# Altium schematic sheet Sheet1.SchDoc
size A
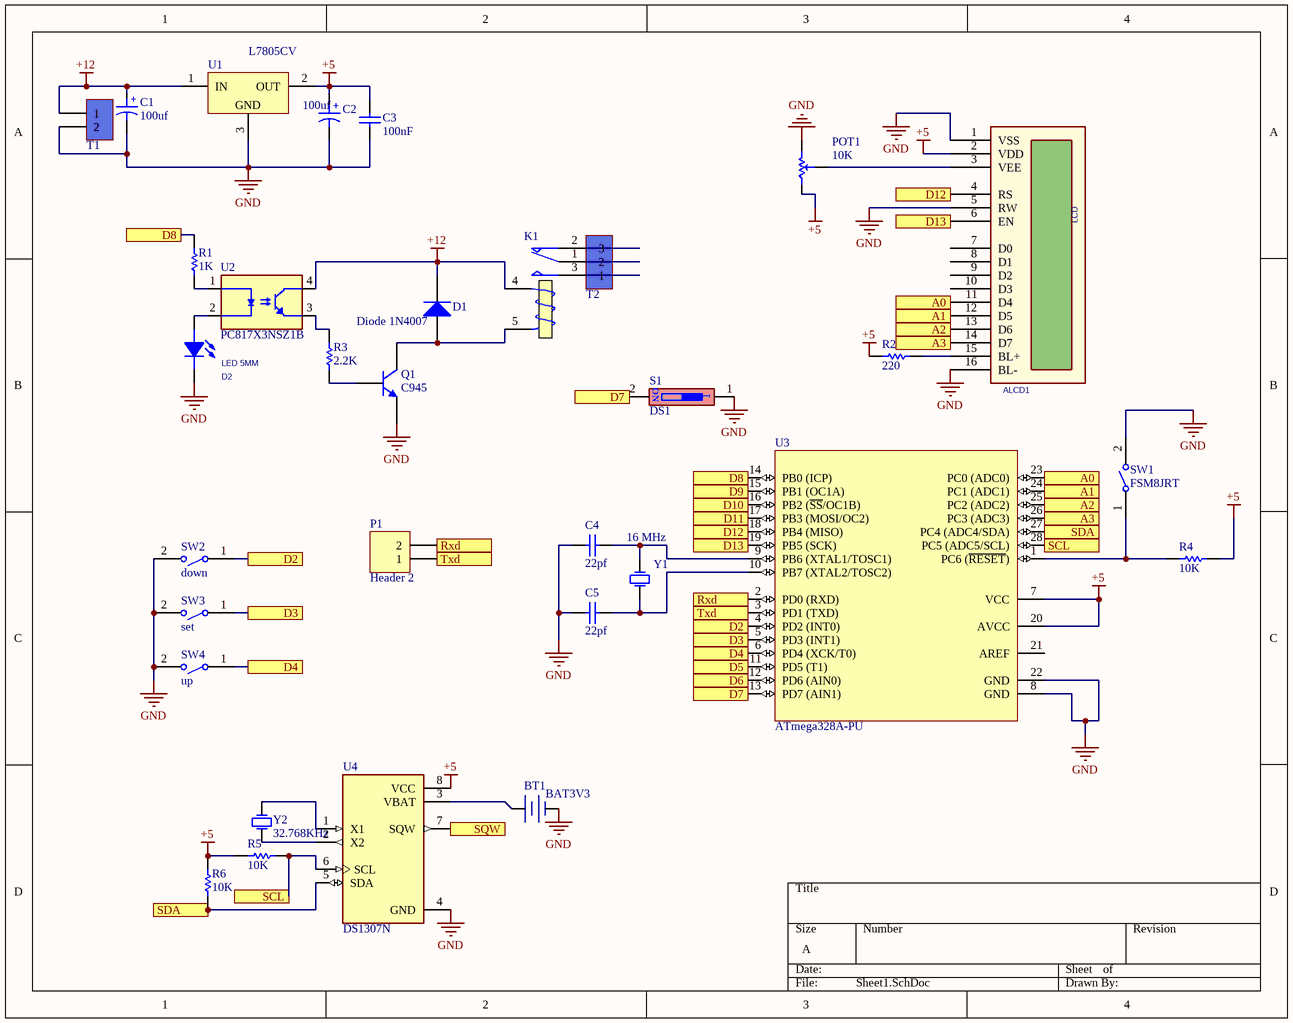
[diagram p0: Sheet1.SchDoc]

## Parts
ALCD1  LCD  [LCD_2X16]
BT1  BAT3V3  [BTH1220]
C1  100uf  [Cap electrolitic radial 8x14-3.5]
C2  100uf  [Cap electrolitic radial 8x14-3.5]
C3  100nF  [Cap-100nF]
C4  22pf  [Cap-100nF]
C5  22pf  [Cap-100nF]
D1  Diode 1N4007  [DO-41]
D2  LED 5MM  [LED5MM_GRN]
K1  (no value)  [Relay 18.85x15.35x15.70]
P1  Header 2  [HDR1X2]
POT1  10K  [POT 4]
Q1  C945  [C945]
R1  1K  [RES-(1/4)]
R2  220  [RES-(1/4)]
R3  2.2K  [RES-(1/4)]
R4  10K  [RES-(1/4)]
R5  10K  [RES-(1/4)]
R6  10K  [RES-(1/4)]
S1  DS1  [DIP Switch x1]
SW1  FSM8JRT  [TE_FSM8JRT]
SW2  down  [TE_FSM8JRT]
SW3  set  [TE_FSM8JRT]
SW4  up  [TE_FSM8JRT]
T1  Terminal  [Terminal 1*2]  (value not drawn)
T2  Terminal  [Terminal 1*3]  (value not drawn)
U1  L7805CV  [78XXCV]
U2  PC817X3NSZ1B  [DIP762W50P254L495H455Q4]
U3  ATmega328A-PU  [28P3]
U4  DS1307N  [DIP762W47P254L991H457Q8]
Y1  16 MHz  [XTAL 16MHZ]
Y2  32.768KHz  [XTAL RTC]

## Ports
A0, A1, A2, A3, D2, D3, D4, D5, D6, D7, D8, D9, D10, D11, D12, D13, Rxd, SCL, SDA, SQW, Txd

## Nets
+5: ALCD1.2(VDD) C2.1 C3.2 POT1.1(CCW) R2.1 R4.2 R5.1 R6.2 U1.2(OUT) U3.7(VCC) U3.20(AVCC) U4.8(VCC)
+12: C1.1 D1.2(K) K1.4(T1) T1.1 U1.1(IN) U2.4(COLLECTOR)
GND: ALCD1.1(VSS) ALCD1.5(RW) ALCD1.16(BL-) BT1.2(-) C1.2 C2.2 C3.1 C4.2 C5.2 D2.2(CATHODE) POT1.2(CW) Q1.1(E) S1.1 SW1.2 SW2.2 SW3.2 SW4.2 T1.2 U1.3(GND) U3.8(GND) U3.22(GND) U4.4(GND)
A0: ALCD1.11(D4) U3.23(PC0_(ADC0)) ; port A0
A1: ALCD1.12(D5) U3.24(PC1_(ADC1)) ; port A1
A2: ALCD1.13(D6) U3.25(PC2_(ADC2)) ; port A2
A3: ALCD1.14(D7) U3.26(PC3_(ADC3)) ; port A3
D2: SW2.1 U3.4(PD2_(INT0)) ; port D2
D3: SW3.1 U3.5(PD3_(INT1)) ; port D3
D4: SW4.1 U3.6(PD4_(XCK/T0)) ; port D4
D5: U3.11(PD5_(T1)) ; port D5
D6: U3.12(PD6_(AIN0)) ; port D6
D7: S1.2 U3.13(PD7_(AIN1)) ; port D7
D8: R1.2 U3.14(PB0_(ICP)) ; port D8
D9: U3.15(PB1_(OC1A)) ; port D9
D10: U3.16(PB2_(~{SS}/OC1B)) ; port D10
D11: U3.17(PB3_(MOSI/OC2)) ; port D11
D12: ALCD1.4(RS) U3.18(PB4_(MISO)) ; port D12
D13: ALCD1.6(EN) U3.19(PB5_(SCK)) ; port D13
Rxd: P1.2 U3.2(PD0_(RXD)) ; port Rxd
SCL: R5.2 U3.28(PC5_(ADC5/SCL)) U4.6(SCL) ; port SCL
SDA: R6.1 U3.27(PC4_(ADC4/SDA)) U4.5(SDA) ; port SDA
SQW: U4.7(SQW) ; port SQW
Txd: P1.1 U3.3(PD1_(TXD)) ; port Txd
NetALCD1_3: ALCD1.3(VEE) POT1.3(SetPoint)
NetALCD1_15: ALCD1.15(BL+) R2.2
NetBT1_1: BT1.1(+) U4.3(VBAT)
NetC4_1: C4.1 U3.9(PB6_(XTAL1/TOSC1)) Y1.2(OSC2)
NetC5_1: C5.1 U3.10(PB7_(XTAL2/TOSC2)) Y1.1(OSC1)
NetD1_1: D1.1(A) K1.5(T2) Q1.2(C)
NetD2_1: D2.1(ANODE) U2.2(CATHODE)
NetK1_1: K1.1(COM) T2.2
NetK1_2: K1.2(NC) T2.3
NetK1_3: K1.3(NO) T2.1
NetQ1_3: Q1.3(B) R3.1
NetR1_1: R1.1 U2.1(ANODE)
NetR3_2: R3.2 U2.3(EMITTER)
NetR4_1: R4.1 SW1.1 U3.1(PC6_(~{RESET}))
NetU4_1: U4.1(X1) Y2.2(OSC2)
NetU4_2: U4.2(X2) Y2.1(OSC1)

Not connected (* = marked no-connect by the designer): ALCD1 7(D0) 8(D1) 9(D2) 10(D3); U3 21(AREF)

## Notes on the sheet
- (in symbol Cap ELECTROLITIC TOTAL SIZE) +
- (in symbol DIP Switch 1) ON

## Library data of the parts
ALCD1 = LCD: Alphanumic LCD; Designer: Abbas Basereh; Data: 16-12-2016
BT1 = Battry Backup: Designer: Abbas Basereh; Data: 16-12-2016; Link: *; Part. No: *
C1 C2 = Cap ELECTROLITIC TOTAL SIZE: Cap electrolitic radial; Designer: Abbas Basereh; VALUE: 1uF; Data: 16-12-2016; Part. No: *
C3-C5 = CAP CERAMIC TOTAL SIZE: CAP Ceramic Total; Designer: Ali Hafizi
D1 = Diode 1N4007: 1 Amp General Purpose Rectifier; Published: 8-Jun-2000; LatestRevisionDate: 17-Jul-2002; LatestRevisionNote: Re-released for DXP Platform.; DatasheetVersion: 1998; PackageVersion: Aug-1999; PackageReference: DO-41; Publisher: Altium Limited; PackageDescription: Diode, Axial; Body 5.2 x 2.7 mm (LxDia. max), Lead Dia. 0.86 mm (max); Code_JEDEC: DO-204-AL; ComponentLink1Description: Manufacturer Link; ComponentLink1URL: http://www.fairchildsemi.com/; ComponentLink2Description: Datasheet; ComponentLink2URL: http://www.fairchildsemi.com/ds/1N%2F1N4001.pdf
D2 = LED 5MM: Light Emitting Diode; Designer: Abbas Basereh; Data: 16-12-2016; Link: *; Part.No: *
K1 = RELAY_SPDT: Single-Pole Dual-Throw Relay; Designer: Abbas Basereh; Mounting Technology: Through-Hole; ComponentLink1Description: Datasheet; Pin Count: 0; Update Date: 2017-3-1
P1 = Header 2: Header, 2-Pin; LatestRevisionDate: 17-Jul-2002; LatestRevisionNote: Re-released for DXP Platform.; Publisher: Altium Limited
POT1 = POT: Variable Resistor; Value: 10K
Q1 = C945: NPN Transistor; Designer: Saeid Jorablo; Company: IPA CO; Last Update Time: 2008/08/04; Value: C945
R1-R6 = RES DIP PACKAGE: TOTAL DIP RESISTOR PACK; Designer: Ali Hafizi
S1 = DIP Switch 1: 1 BIT DIP Switch
SW1-SW4 = FSM8JRT: Switch Tactile OFF _ON_ SPST Round Button PC Pins 0.05A 12VDC 1.57N Thru-Hole Radial Tape; Contact_Current_Rating: 50 mA; MF: TE Connectivity; Configuration_Pole-Throw: Single Pole - Single Throw; Availability: Unavailable; Price: None; SnapEDA_Link: https://www.snapeda.com/parts/FSM8JRT/TE%20Connectivity%20ALCOSWITCH%20Switches/view-part/226999/?ref=snap; EU_RoHS_Compliance: Compliant; Value: *; Package: None; TE_purchase_URL: https://www.te.com/usa-en/product-147694-1.html?te_bu=Cor&te_type=disp&te_campaign=seda_glo_cor-seda-global-disp-prtnr-fy19-seda-model-bom-cta_sma-317_1&elqCampaignId=32493; MP: FSM8JRT
T1 = Terminal 1*2: Terminal 2 Pin 250VAC 16A; Designer: Seyed Mohsen Ghasemain; E-mail: picpars@gmail.com; ComponentLinkURL: www.picpars.com
T2 = Terminal 1*3: Terminal 3 Pin 250VAC 16A; Designer: Seyed Mohsen Ghasemain; E-mail: picpars@gmail.com; ComponentLinkURL: www.picpars.com
U1 = L78XXCV: Fixed Voltage Regulator; Designer: Saeid Jorablo; Company: ControTec; Adding Date: 1387/01/06; Voltage: *
U2 = PC817X3NSZ1B: Optoisolator Transistor Output 1 Channel 4-DIP; MF: Sharp Microelectronics; Availability: Good; MP: PC817X3NSZ1B; SnapEDA_Link: https://www.snapeda.com/parts/PC817X3NSZ1B/Sharp%20Microelectronics/view-part/5163575/?ref=snap; Value: *; Price: None; Check_prices: https://www.snapeda.com/parts/PC817X3NSZ1B/Sharp%20Microelectronics/view-part/5163575/?ref=eda; Purchase-URL: https://pricing.snapeda.com/search/part/PC817X3NSZ1B/?ref=eda; Package: None
U3 = ATmega8A-PU: 8-bit AVR Microcontroller, 8KB Flash, 512 Bytes EEPROM, 1KB SRAM, 28-pin PDIP, Industrial Grade (-40°C to 85°C); Published: 2017-1-5; DatasheetVersion: 2017-1-5; PackageVersion: 2017-1-5; PackageReference: 28P3; Publisher: Abbas Basereh; PackageDescription: 28-lead (0.300"/7.62mm Wide) Plastic Dual Inline Package (PDIP); Supplier 1: Digi-Key; Supplier Part Number 1: ATMEGA8A-PU-ND; Supplier 2: Farnell; Supplier Part Number 2: 1748534; Supplier 3: Mouser; Supplier Part Number 3: 556-ATMEGA8A-PU; ComponentLink1Description: Manufacturer Link; ComponentLink1URL: http://www.atmel.com/products/avr/default.asp?; ComponentLink2Description: ATmega8A Datasheet; ComponentLink2URL: http://www.atmel.com/dyn/resources/prod_documents/doc8159.pdf; ComponentLink3Description: ATmega8A Summary; ComponentLink3URL: http://www.atmel.com/dyn/resources/prod_documents/8159S.pdf; ComponentLink4Description: Atmel.com Home; ComponentLink4URL: http://www.atmel.com
U4 = DS1307N: Real Time Clock _RTC_ IC Clock/Calendar 56B IÂ²C, 2-Wire Serial 8-DIP _0.300, 7.62mm_; MF: Maxim Integrated; Availability: Unavailable; SnapEDA_Link: https://www.snapeda.com/parts/DS1307N/Maxim%20Integrated/view-part/9754/?ref=snap; MP: DS1307N; Value: *; Price: None; Package: DIP-8 Maxim Integrated
Y1 Y2 = XTAL: XTAL Crystal; Designer: ABBAS BASEREH; Value: 12 MHz; Design Date: 2017-1-3; ComponentLink1Description: Datasheet; ComponentLink2Description: Reference; Mounting Technology: Surface Mount\Through-Hole; Status: Unreleased